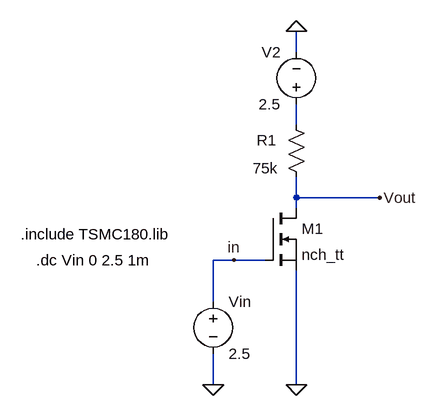
[diagram p0: schematic q5a.asc]
q5a.asc, the LTspice schematic file:
Version 4
SHEET 1 880 680
WIRE 224 -112 224 -144
WIRE 224 0 224 -32
WIRE 224 112 224 80
WIRE 352 112 224 112
WIRE 224 128 224 112
WIRE 128 208 96 208
WIRE 176 208 128 208
WIRE 96 272 96 208
WIRE 96 400 96 352
WIRE 224 400 224 224
FLAG 224 -144 0
FLAG 352 112 Vout
FLAG 128 208 in
FLAG 96 400 0
FLAG 224 400 0
SYMBOL nmos 176 128 R0
SYMATTR InstName M1
SYMATTR Value nch_tt
SYMATTR Value2 l=180n w=270n
SYMBOL voltage 96 256 R0
SYMATTR InstName Vin
SYMATTR Value 2.5
SYMBOL res 208 -16 R0
WINDOW 0 -45 40 Left 2
WINDOW 3 -51 83 Left 2
SYMATTR InstName R1
SYMATTR Value 75k
SYMBOL voltage 224 -16 R180
WINDOW 0 24 96 Left 2
WINDOW 3 24 16 Left 2
WINDOW 123 0 0 Left 0
WINDOW 39 0 0 Left 0
SYMATTR InstName V2
SYMATTR Value 2.5
TEXT -200 168 Left 2 !.include TSMC180.lib
TEXT -176 208 Left 2 !.dc Vin 0 2.5 1m

The netlist it stands for:
* q5a.asc
M1 Vout in 0 0 nch_tt l=180n w=270n
Vin in 0 2.5
R1 N001 Vout 75k
V2 N001 0 2.5
.model NMOS NMOS
.model PMOS PMOS
.lib standard.mos
.include TSMC180.lib
.dc Vin 0 2.5 1m
.backanno
.end

* Results of the author's LTspice run, read from the files saved beside the schematic
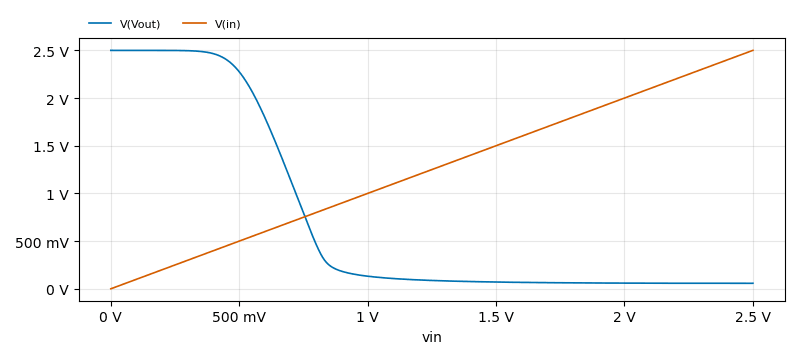
[diagram p1: DC transfer characteristic of q5a.asc, plotted from the saved traces]
* DC transfer characteristic, 1 run:
*   V(Vout): 2.5 V at vin=0 V, 57.82 mV at vin=2.5 V, min 57.77 mV, max 2.5 V
*   V(in): 0 V at vin=0 V, 2.5 V at vin=2.5 V, min 0 V, max 2.5 V